# EAGLE design LED PCB (EAGLE 9.6.1)
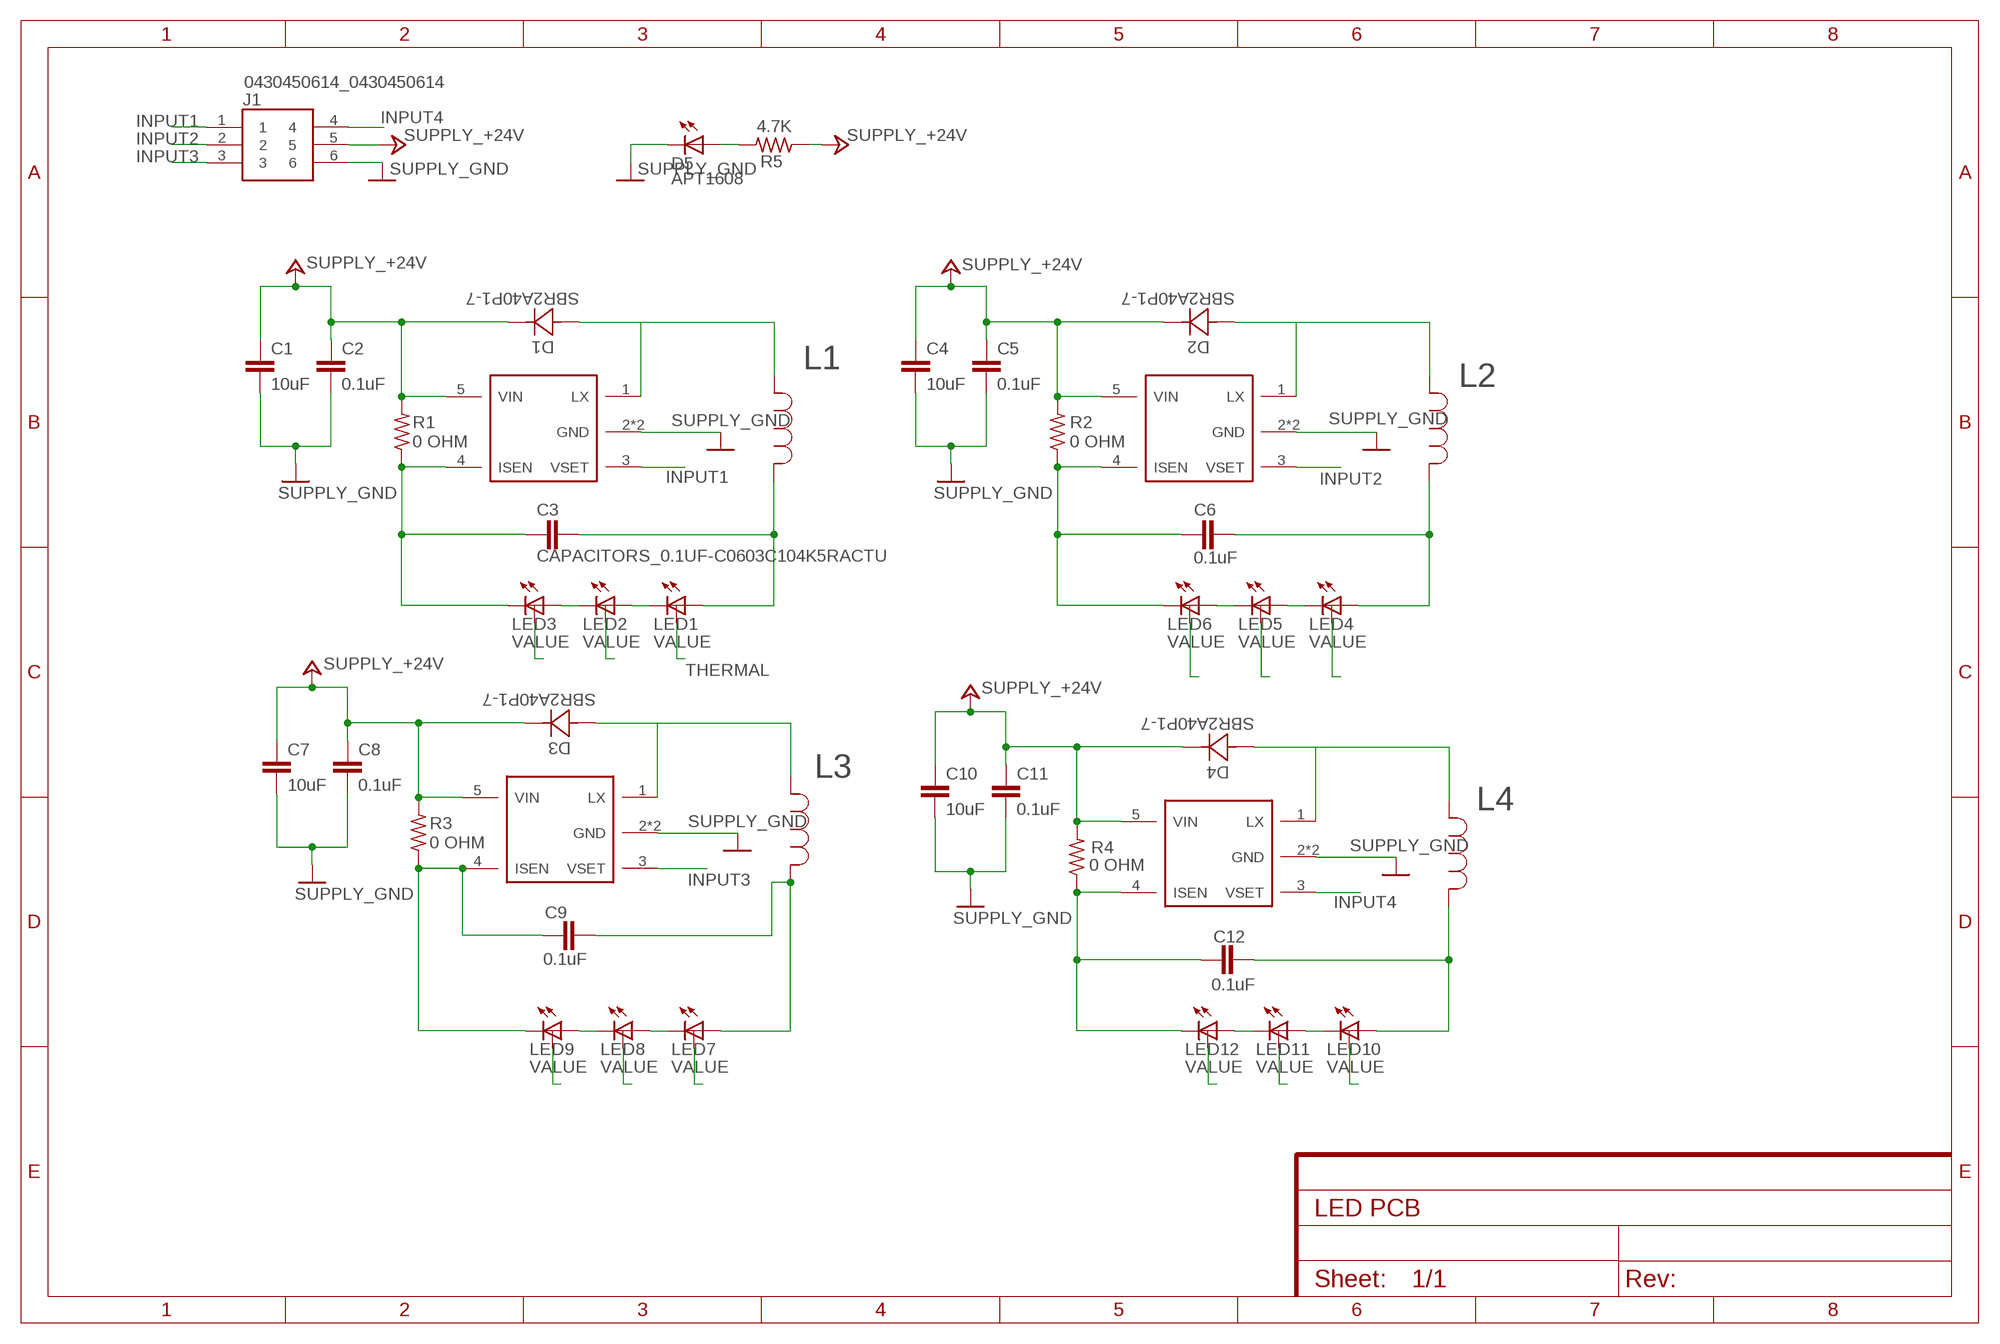
[diagram p0: schematic, sheet 1]

## Parts
C1  10uF  CAPACITORS_10UF-GMK212BBJ106KG-T  [CAPACITORS_C0805]
C2  0.1uF  CAPACITORS_0.1UF-C0603C104K5RACTU  [CAPACITORS_C0603]
C3  CAPACITORS_0.1UF-C0603C104K5RACTU  [CAPACITORS_C0603]
C4  10uF  CAPACITORS_10UF-GMK212BBJ106KG-T  [CAPACITORS_C0805]
C5  0.1uF  CAPACITORS_0.1UF-C0603C104K5RACTU  [CAPACITORS_C0603]
C6  0.1uF  CAPACITORS_0.1UF-C0603C104K5RACTU  [CAPACITORS_C0603]
C7  10uF  CAPACITORS_10UF-GMK212BBJ106KG-T  [CAPACITORS_C0805]
C8  0.1uF  CAPACITORS_0.1UF-C0603C104K5RACTU  [CAPACITORS_C0603]
C9  0.1uF  CAPACITORS_0.1UF-C0603C104K5RACTU  [CAPACITORS_C0603]
C10  10uF  CAPACITORS_10UF-GMK212BBJ106KG-T  [CAPACITORS_C0805]
C11  0.1uF  CAPACITORS_0.1UF-C0603C104K5RACTU  [CAPACITORS_C0603]
C12  0.1uF  CAPACITORS_0.1UF-C0603C104K5RACTU  [CAPACITORS_C0603]
D1  SBR2A40P1-7  DIODES_SBR2A40P1-7  [DIODES_POWERDI123]
D2  SBR2A40P1-7  DIODES_SBR2A40P1-7  [DIODES_POWERDI123]
D3  SBR2A40P1-7  DIODES_SBR2A40P1-7  [DIODES_POWERDI123]
D4  SBR2A40P1-7  DIODES_SBR2A40P1-7  [DIODES_POWERDI123]
D5  APT1608  DIODES_APT1608CGCK  [DIODES_CHIPLED_0603]
J1  0430450614_0430450614  [0430450614_MOLEX_0430450614]
L1  INDUCTORS_100UH_BOURNES  [INDUCTORS_IND_BOURNS_SDR1307]
L2  INDUCTORS_100UH_BOURNES  [INDUCTORS_IND_BOURNS_SDR1307]
L3  INDUCTORS_100UH_BOURNES  [INDUCTORS_IND_BOURNS_SDR1307]
L4  INDUCTORS_100UH_BOURNES  [INDUCTORS_IND_BOURNS_SDR1307]
LED1  PFCEDU_V4_TOMASZEWSKI_LED_W/THERM-CREE_XP-E2  [TOMASZEWSKI_CREE-XLAMP@1]
LED2  TOMASZEWSKI_LED_W/THERM-CREE_XP-E2  PFCEDU_V4_TOMASZEWSKI_LED_W/THERM-CREE_XP-E2  [TOMASZEWSKI_CREE-XLAMP@1]
LED3  PFCEDU_V4_TOMASZEWSKI_LED_W/THERM-CREE_XP-E2  [TOMASZEWSKI_CREE-XLAMP@1]
LED4  PFCEDU_V4_TOMASZEWSKI_LED_W/THERM-CREE_XP-E2  [TOMASZEWSKI_CREE-XLAMP@1]
LED5  PFCEDU_V4_TOMASZEWSKI_LED_W/THERM-CREE_XP-E2  [TOMASZEWSKI_CREE-XLAMP@1]
LED6  PFCEDU_V4_TOMASZEWSKI_LED_W/THERM-CREE_XP-E2  [TOMASZEWSKI_CREE-XLAMP@1]
LED7  PFCEDU_V4_TOMASZEWSKI_LED_W/THERM-CREE_XP-E2  [TOMASZEWSKI_CREE-XLAMP@1]
LED8  PFCEDU_V4_TOMASZEWSKI_LED_W/THERM-CREE_XP-E2  [TOMASZEWSKI_CREE-XLAMP@1]
LED9  PFCEDU_V4_TOMASZEWSKI_LED_W/THERM-CREE_XP-E2  [TOMASZEWSKI_CREE-XLAMP@1]
LED10  PFCEDU_V4_TOMASZEWSKI_LED_W/THERM-CREE_XP-E2  [TOMASZEWSKI_CREE-XLAMP@1]
LED11  PFCEDU_V4_TOMASZEWSKI_LED_W/THERM-CREE_XP-E2  [TOMASZEWSKI_CREE-XLAMP@1]
LED12  PFCEDU_V4_TOMASZEWSKI_LED_W/THERM-CREE_XP-E2  [TOMASZEWSKI_CREE-XLAMP@1]
R1  0 OHM  RESISTORS_0OHM-RC0603JR-070RL  [RESISTORS_RC0603N]
R2  0 OHM  RESISTORS_0OHM-RC0603JR-070RL  [RESISTORS_RC0603N]
R3  0 OHM  RESISTORS_0OHM-RC0603JR-070RL  [RESISTORS_RC0603N]
R4  0 OHM  RESISTORS_0OHM-RC0603JR-070RL  [RESISTORS_RC0603N]
R5  4.7K  RESISTORS_4.7K-RC1206JR-074K7L  [RESISTORS_R1206]
U$1  DRIVER-IC_AL8861  [DRIVER-IC_AL8861]
U$3  DRIVER-IC_AL8861  [DRIVER-IC_AL8861]
U$5  DRIVER-IC_AL8861  [DRIVER-IC_AL8861]
U$7  DRIVER-IC_AL8861  [DRIVER-IC_AL8861]

## Nets
+24V: C1.1 C2.1 C4.1 C5.1 C7.1 C8.1 C10.1 C11.1 D1.- D2.- D3.- D4.- J1.5 R1.2 R2.2 R3.2 R4.2 R5.1 U$1.5(VIN) U$3.5(VIN) U$5.5(VIN) U$7.5(VIN) ; supply symbol labelled SUPPLY_+24V
GND: C1.2 C2.2 C4.2 C5.2 C7.2 C8.2 C10.2 C11.2 D5.C J1.6 U$1.2(GND) U$1.44(GND) U$3.2(GND) U$3.44(GND) U$5.2(GND) U$5.44(GND) U$7.2(GND) U$7.44(GND) ; supply symbol labelled SUPPLY_GND
INPUT1: J1.1 U$1.3(VSET)
INPUT2: J1.2 U$3.3(VSET)
INPUT3: J1.3 U$5.3(VSET)
INPUT4: J1.4 U$7.3(VSET)
N$1: C3.1 LED3.C LED3.C@1(C) R1.1 U$1.4(ISEN)
N$2: D1.+ L1.2 U$1.1(LX)
N$3: C9.2 L3.1 LED7.A LED7.A@1(A)
N$4: C3.2 L1.1 LED1.A LED1.A@1(A)
N$5: LED2.C LED2.C@1(C) LED3.A LED3.A@1(A)
N$6: LED1.C LED1.C@1(C) LED2.A LED2.A@1(A)
N$7: D3.+ L3.2 U$5.1(LX)
N$8: LED5.C LED5.C@1(C) LED6.A LED6.A@1(A)
N$9: LED4.C LED4.C@1(C) LED5.A LED5.A@1(A)
N$10: C12.1 LED12.C LED12.C@1(C) R4.1 U$7.4(ISEN)
N$11: D4.+ L4.2 U$7.1(LX)
N$12: LED8.C LED8.C@1(C) LED9.A LED9.A@1(A)
N$13: LED7.C LED7.C@1(C) LED8.A LED8.A@1(A)
N$14: LED6.THERM
N$15: LED5.THERM
N$16: LED11.C LED11.C@1(C) LED12.A LED12.A@1(A)
N$17: LED10.C LED10.C@1(C) LED11.A LED11.A@1(A)
N$18: C6.1 LED6.C LED6.C@1(C) R2.1 U$3.4(ISEN)
N$19: D2.+ L2.2 U$3.1(LX)
N$20: C6.2 L2.1 LED4.A LED4.A@1(A)
N$21: C12.2 L4.1 LED10.A LED10.A@1(A)
N$22: C9.1 LED9.C LED9.C@1(C) R3.1 U$5.4(ISEN)
N$23: D5.A R5.2
N$24: LED4.THERM
N$25: LED9.THERM
N$26: LED8.THERM
N$27: LED7.THERM
N$28: LED12.THERM
N$29: LED11.THERM
N$30: LED10.THERM
N$32: LED3.THERM
N$44: LED2.THERM
THERMAL: LED1.THERM

## Library data of the parts
C1 C4 C7 C10 = LED:CAPACITORS_10UF-GMK212BBJ106KG-T: CAP CER 10UF 35V X5R 0805 Description: 10µF ±10% 35V Ceramic Capacitor X5R 0805 (2012 Metric) Technical Specifications: Capacitance: 10µF Tolerance: ±10% Rated Voltage: 35V Temperature Coefficient: X5R Operating Temperature: -55°C ~ 85°C Package / Case: 0805 (2012 Metric) Datasheet(s): GMK212BBJ106KG-T Spec <http://ds.yuden.co.jp/TYCOMPAS/ut/detail.do?productNo=GMK212BBJ106KG-T&fileName=GMK212BBJ106KG-T_SS&mode=specSheetDownload> Vendor(s): Digikey: 587-4893-1-ND <https://www.digikey.com/product-detail/en/taiyo-yuden/GMK212BBJ106KG-T/587-4893-1-ND/6563736>; MANUFACTURER: Taiyo Yuden; MPN: GMK212BBJ106KG-T; VENDOR: Digikey; VLINK: https://www.digikey.com/product-detail/en/taiyo-yuden/GMK212BBJ106KG-T/587-4893-1-ND/6563736; VPN: 587-4893-1-ND
C2 C5 C6 C8 C9 C11 C12 = LED:CAPACITORS_0.1UF-C0603C104K5RACTU: CAP CER 0.1UF 50V X7R 0603 Description: 0.1µF ±10% 50V Ceramic Capacitor X7R 0603 (1608 Metric) Technical Specifications: Capacitance: 0.1µF Tolerance: ±10% Rated Voltage: 50V Temperature Coefficient: X7R Operating Temperature: -55°C ~ 125°C Package / Case: 0603 (1608 Metric) Datasheet(s): X7R Dielectric, 6.3-250 VDC <https://search.kemet.com/component-edge/download/datasheet/C0603C104K5RACTU.pdf> Vendor(s): Digikey: 399-5089-1-ND <https://www.digikey.com/product-detail/en/kemet/C0603C104K5RACTU/399-5089-1-ND/1465623>; MANUFACTURER: Kemet; MPN: C0603C104K5RACTU; VENDOR: Digikey; VLINK: https://www.digikey.com/product-detail/en/kemet/C0603C104K5RACTU/399-5089-1-ND/1465623; VPN: 399-5089-1-ND
C3 = LED:CAPACITORS_0.1UF-C0603C104K5RACTU: CAP CER 0.1UF 50V X7R 0603 Description: 0.1µF ±10% 50V Ceramic Capacitor X7R 0603 (1608 Metric) Technical Specifications: Capacitance: 0.1µF Tolerance: ±10% Rated Voltage: 50V Temperature Coefficient: X7R Operating Temperature: -55°C ~ 125°C Package / Case: 0603 (1608 Metric) Datasheet(s): X7R Dielectric, 6.3-250 VDC <https://search.kemet.com/component-edge/download/datasheet/C0603C104K5RACTU.pdf> Vendor(s): Digikey: 399-5089-1-ND <https://www.digikey.com/product-detail/en/kemet/C0603C104K5RACTU/399-5089-1-ND/1465623>; MANUFACTURER: Kemet; MPN: C0603C104K5RACTU; VALUE: 0.1uF; VENDOR: Digikey; VLINK: https://www.digikey.com/product-detail/en/kemet/C0603C104K5RACTU/399-5089-1-ND/1465623; VPN: 399-5089-1-ND
D1-D4 = LED:DIODES_SBR2A40P1-7: DIODE SBR 40V 2A POWERDI123 Description: Diode Super Barrier 40V 2A Surface Mount PowerDI™ 123 Technical Specifications: Diode Type: Super Barrier Voltage - DC Reverse (Vr) (Max): 40V Current - Average Rectified (Io): 2A Voltage - Forward (Vf) (Max) @ If: 500mV @ 2A Speed: Standard Recovery >500ns, > 200mA (Io) Current - Reverse Leakage @ Vr: 100µA @ 40V Mounting Type: Surface Mount Package / Case: POWERDI®123 Supplier Device Package: PowerDI™ 123 Operating Temperature - Junction: -65°C ~ 150°C Base Part Number: SBR2A40 Datasheet(s): SBR2A40P1 <https://www.diodes.com/assets/Datasheets/SBR2A40P1.pdf> Vendor(s): Digikey: SBR2A40P1DITR-ND <https://www.digikey.com/product-detail/en/diodes-incorporated/SBR2A40P1-7/SBR2A40P1DITR-ND/1681825>; MANUFACTURER: Diodes Incorporated; MPN: SBR2A40P1-7; VENDOR: Digikey; VLINK: https://www.digikey.com/product-detail/en/diodes-incorporated/SBR2A40P1-7/SBR2A40P1DITR-ND/1681825; VPN: SBR2A40P1DITR-ND
D5 = LED:DIODES_APT1608CGCK: LED GREEN CLEAR 0603 SMD Description: Green 570nm LED Indication - Discrete 2.1V 0603 (1608 Metric) Technical Specifications: Color: Green Lens Color: Colorless Lens Transparency: Clear Millicandela Rating: 50mcd Lens Style/Size: Rectangle with Flat Top, 1.20mm x 0.80mm Voltage - Forward (Vf) (Typ): 2.1V Current - Test: 20mA Viewing Angle: 120° Mounting Type: Surface Mount Wavelength - Dominant: 570nm Wavelength - Peak: 574nm Package / Case: 0603 (1608 Metric) Supplier Device Package: Chip LED Size / Dimension: 1.60mm L x 0.80mm W Height (Max): 0.75mm Datasheet(s): APT1608CGCK <http://www.kingbrightusa.com/images/catalog/SPEC/APT1608CGCK.pdf> Vendor(s): Digikey: 754-1116-1-ND <https://www.digikey.com/product-detail/en/kingbright/APT1608CGCK/754-1116-1-ND/1747833#>; MANUFACTURER: Kingbright; MPN: APT1608CGCK; VENDOR: Digikey; VLINK: https://www.digikey.com/product-detail/en/kingbright/APT1608CGCK/754-1116-1-ND/1747833#; VPN: 754-1116-1-ND
J1 = LED:0430450614_0430450614: Conn Power HDR 6 POS 3mm Solder ST Thru-Hole 6 Terminal 1 Port Micro-Fit 3.0Ã¢â¢ Tray; AVAILABILITY: Unavailable; DESCRIPTION: Connector Header Through Hole 6 position 0.118 _3.00mm_; MF: Molex; MP: 0430450614; PACKAGE: None; PRICE: None
L1-L4 = LED:INDUCTORS_100UH_BOURNES: Bourne - FIXED IND 100UH 1.9A 180 MOHM Technical Specifications: Inductance: 100uH Rated Current: 1.9A Saturation Current: 3.0A DC Resistance: 180mΩ Operating Temperature: -40° C to 125°C Datasheet(s): 100uH Bourne <http://www.bourns.com/docs/Product-Datasheets/SDR1307.pdf> Vendors: Digikey: SDR1307-101KLCT-ND <https://www.digikey.com/product-detail/en/bourns-inc/SDR1307-101KL/SDR1307-101KLCT-ND/3437739>
LED1 LED3-LED12 = LED:PFCEDU_V4_TOMASZEWSKI_LED_W/THERM
LED2 = LED:PFCEDU_V4_TOMASZEWSKI_LED_W/THERM; SPICEPREFIX: J
R1-R4 = LED:RESISTORS_0OHM-RC0603JR-070RL: RES SMD 0 OHM JUMPER 1/10W 0603 Description: 0 Ohms Jumper 0.1W, 1/10W Chip Resistor 0603 (1608 Metric) Moisture Resistant Thick Film Technical Specifications: Resistance: 0 Ohms Power: 0.1W, 1/10W Operating Temperature: -55°C ~ 155°C Package / Case: 0603 (1608 Metric) Datasheet(s): RC Series, L Datasheet <http://www.yageo.com/documents/recent/PYu-RC_Group_51_RoHS_L_8.pdf> Vendor(s): Digikey: 311-0.0GRCT-ND <https://www.digikey.com/product-detail/en/yageo/RC0603JR-070RL/311-0.0GRCT-ND/729622>; MANUFACTURER: Yageo; MPN: RC0603JR-070RL; VENDOR: Digikey; VLINK: https://www.digikey.com/product-detail/en/yageo/RC0603JR-070RL/311-0.0GRCT-ND/729622; VPN: 311-0.0GRCT-ND
R5 = LED:RESISTORS_4.7K-RC1206JR-074K7L: RES SMD 4.7K OHM 5% 1/4W 1206 Description: 4.7 kOhms ±5% 0.25W, 1/4W Chip Resistor 1206 (3216 Metric) Moisture Resistant Thick Film Technical Specifications: Resistance: 4.7 kOhms Tolerance: ±5% Power (Watts): 0.25W, 1/4W Composition: Thick Film Features: Moisture Resistant Temperature Coefficient: ±100ppm/°C Operating Temperature: -55°C ~ 155°C Package / Case: 1206 (3216 Metric) Supplier Device Package: 1206 Size / Dimension: 0.122" L x 0.063" W (3.10mm x 1.60mm) Height - Seated (Max): 0.026" (0.65mm) Number of Terminations: 2 Datasheet(s): Thick Film Chip Resistor Intro <http://www.yageo.com.tw/exep/pages/download/literatures/PYu-R_INT-thick_7.pdf> Chip Resistor Marking <http://www.yageo.com/exep/pages/download/literatures/PYu-R_Marking_2.pdf> RC Series, L Datasheet <http://www.yageo.com/documents/recent/PYu-RC_Group_51_RoHS_L_8.pdf> Vendor(s): Digikey: 311-4.7KERCT-ND <https://www.digikey.com/product-detail/en/yageo/RC1206JR-074K7L/311-4.7KERCT-ND/732242>; MANUFACTURER: Yageo; MPN: RC1206JR-074K7L; VENDOR: Digikey; VLINK: https://www.digikey.com/product-detail/en/yageo/RC1206JR-074K7L/311-4.7KERCT-ND/732242; VPN: 311-4.7KERCT-ND
U$1 U$3 U$5 U$7 = LED:DRIVER-IC_AL8861: AL8861 LED Driver IC Description: IC LED DRVR REG PWM 1.5A SOT89-5 Technical Specifications: Type: IC Voltage In: 4.5V - 40V Current Out: Up to 1.5A Frequency: 1Mhz Dimming: PWM or Analog Package SOT-89-5 Operating Temperature: -40°C ~ 85°C (TA) Datasheet(s): Diodes AL8861 <https://www.mouser.com/ds/2/115/AL8861-1094677.pdf> Vendor(s): Digikey: Diodes AL8861 <https://www.digikey.com/product-detail/en/diodes-incorporated/AL8861Y-13/AL8861Y-13DICT-ND/6702378>

## Board
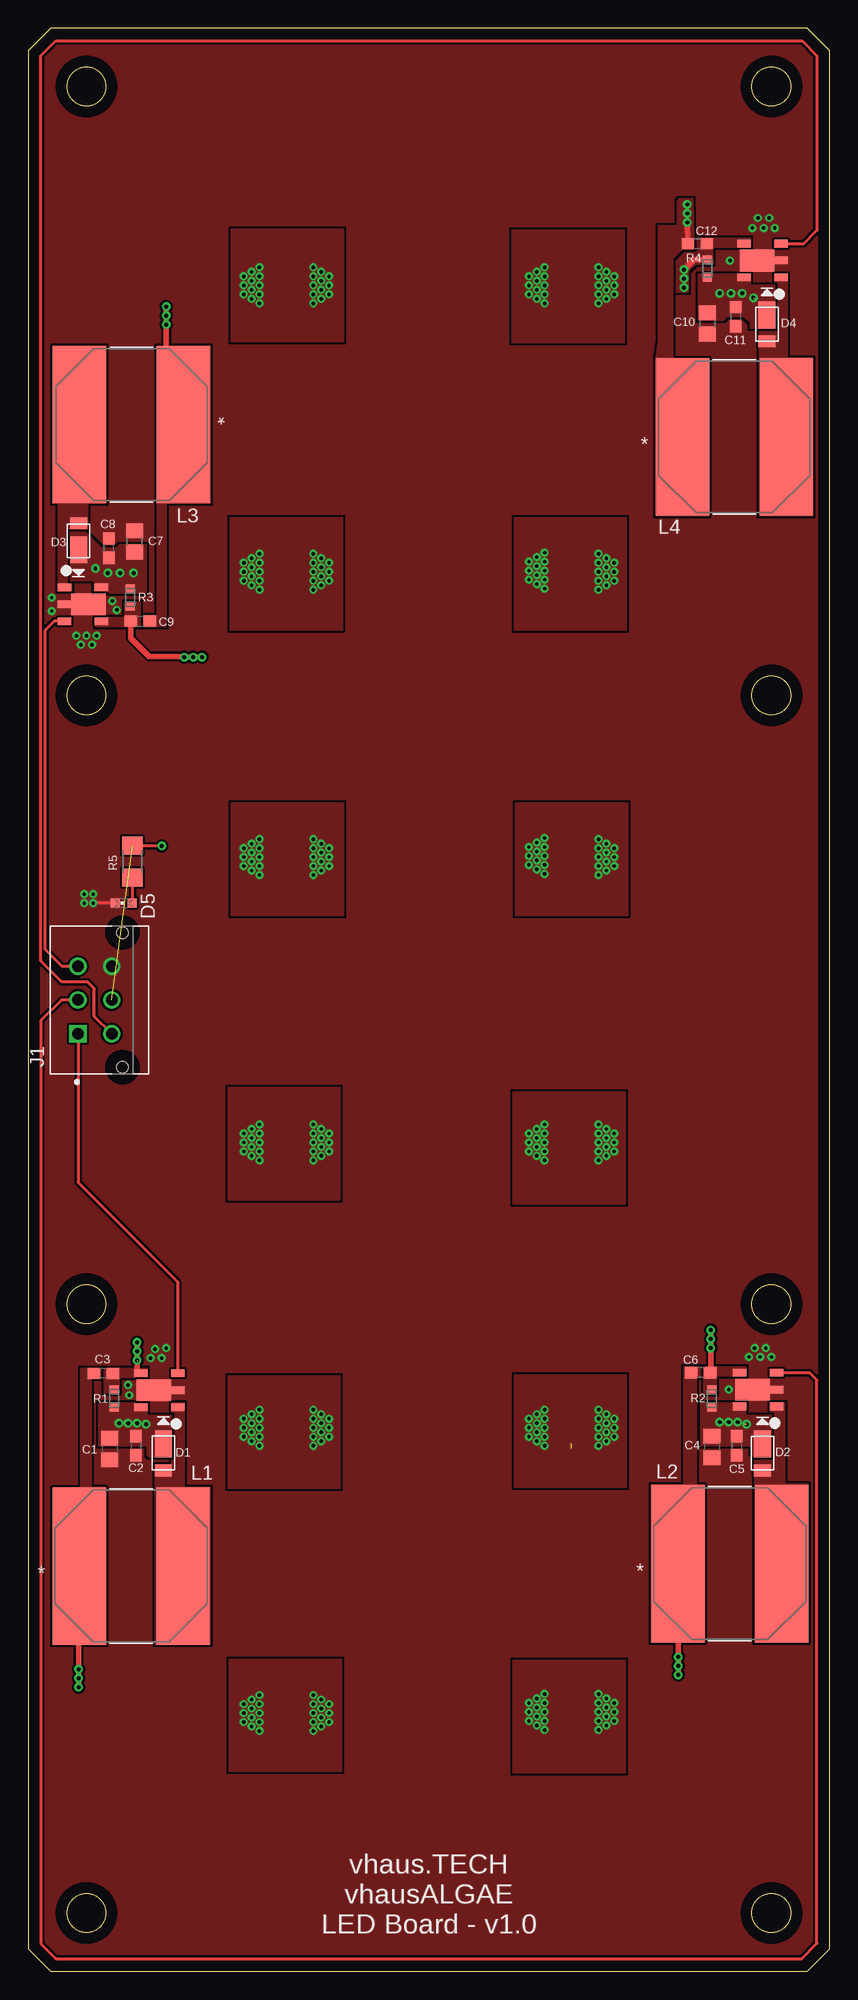
[diagram p1: board, top side]
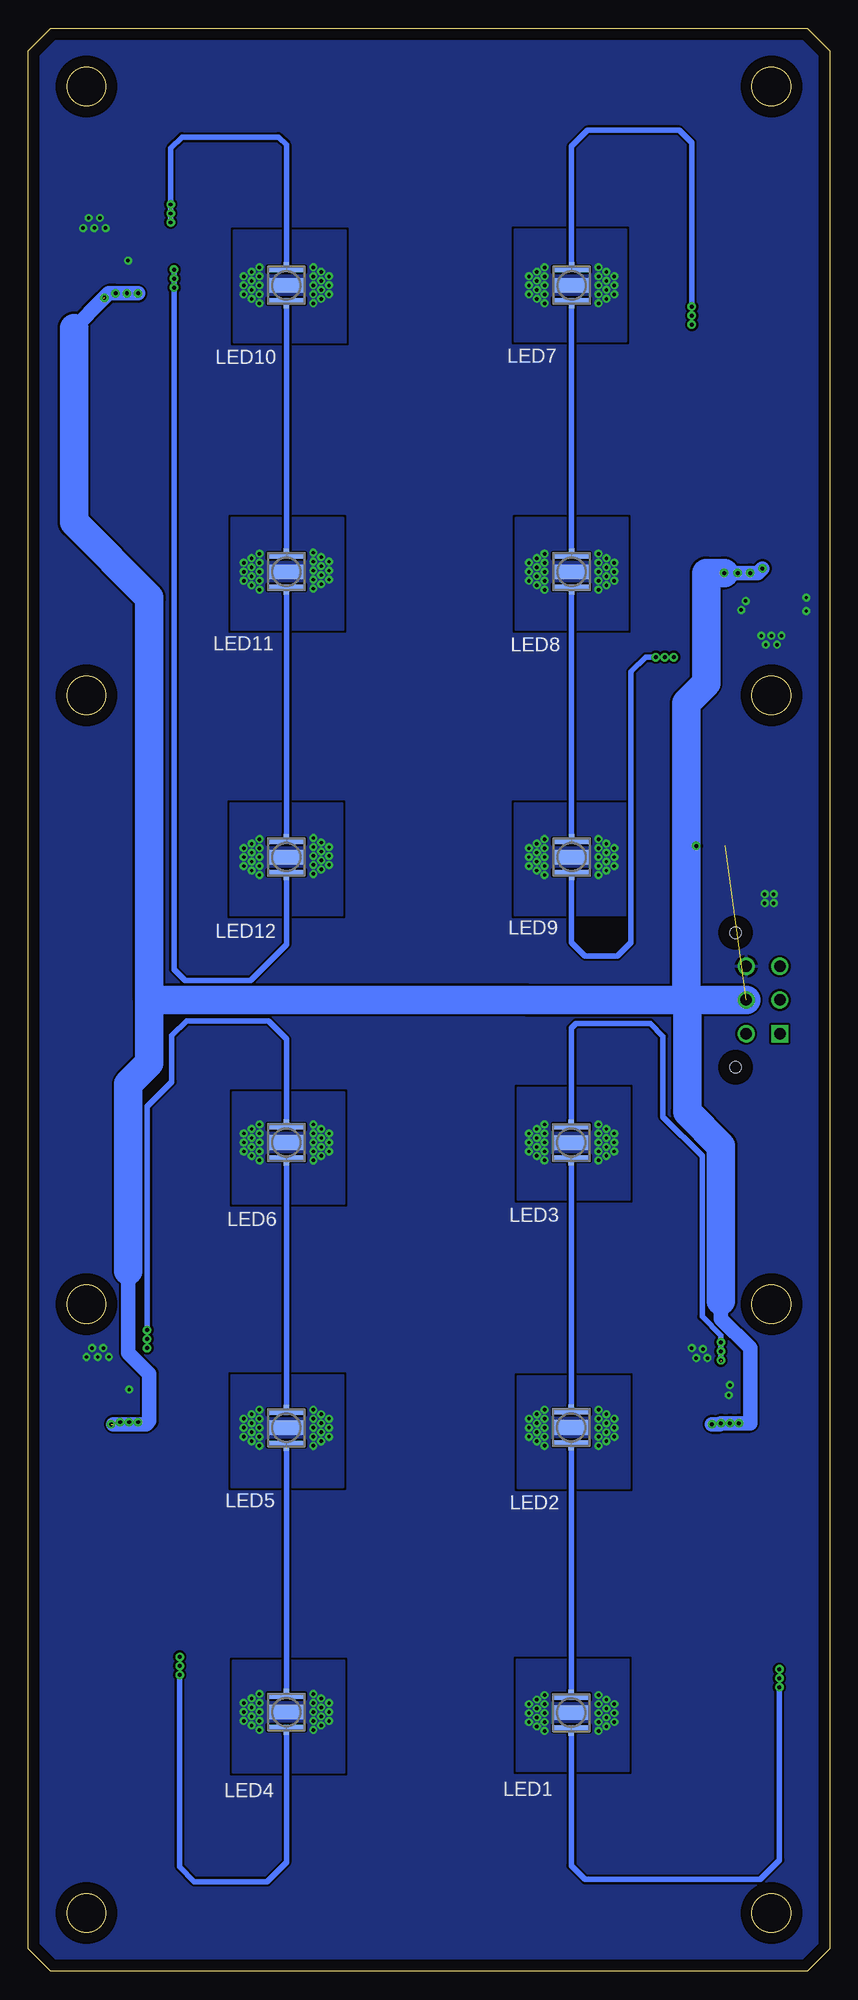
[diagram p2: board, bottom side, seen from below]

Size 71.4 x 173 mm. Coordinates in mm from the lower left corner, seen from the top.
Outline: 71.4,171 69.4,173 2,173 0,171 0,2 2,0 69.4,0 71.4,2 71.4,171
Outline: circle at 5.2,167.8 radius 1.73
Outline: circle at 5.2,5.2 radius 1.73
Outline: circle at 66.2,5.2 radius 1.73
Outline: circle at 66.2,113.6 radius 1.73
Outline: circle at 66.2,59.4 radius 1.73
Outline: circle at 5.2,59.4 radius 1.73
Outline: circle at 5.2,113.6 radius 1.73
Outline: circle at 66.2,167.8 radius 1.73
Copper layers (1*16): Top 0.035mm / dielectric 1.5mm / Bottom 0.035mm
Design rules "default *": minimum track width 6mil, minimum drill 0.35mm, track to track 6mil, track to pad 6mil, pad to pad 6mil, via to via 6mil, smd to smd 6mil, copper to edge 40mil, drill to drill 6mil, minimum pad ring 10mil, minimum via ring 8mil, stop-mask expansion 4mil, vias tented up to drill 0.35mm, thermal gap 10mil

### Footprints (pad centres in the part's own frame; a part is rotated, then mirrored left to right if it is on the bottom)
CAPACITORS_C0805 = smd 1.3 x 1.5: 1 -0.95,0; 2 0.95,0
CAPACITORS_C0603 = smd 1.1 x 1: 1 -0.85,0; 2 0.85,0
DIODES_POWERDI123 = smd 1.05 x 1.5: + -1.3,0 | smd 2.4 x 1.5: - 1.05,0
DIODES_CHIPLED_0603 = smd 0.8 x 0.8: A 0,-0.75; C 0,0.75
0430450614_MOLEX_0430450614 = drill 1.02 square: 1 -3,1.5 | drill 1.02: 2 0,1.5; 3 3,1.5; 4 -3,-1.5; 5 0,-1.5; 6 3,-1.5 | hole 1.02: 6,-2.44; -6,-2.44
INDUCTORS_IND_BOURNS_SDR1307 = smd 4.75 x 13.995: 1 -4.623,0; 2 4.623,0
TOMASZEWSKI_CREE-XLAMP@1 = smd 0.5 x 3.3: A 1.4,0; C -1.4,0 | smd 0.45 x 0.5: A@1 1.825,0; C@1 -1.825,0 | smd 1.3 x 3.3: THERM 0,0
RESISTORS_RC0603N = smd 0.756 x 0.8: 1 -0.778,0; 2 0.778,0
RESISTORS_R1206 = smd 1.6 x 1.803: 1 -1.422,0; 2 1.422,0
DRIVER-IC_AL8861 = smd 0.68 x 1.2: 1 -1.5,-1.65; 2 0,-1.65; 3 1.5,-1.65; 4 1.5,1.65; 5 -1.5,1.65 | smd 1.93 x 3.05: 44 0,0.475

### Placement (x,y rotation side)
C1  7.27,46.52 270 top
C2  9.6,46.8 270 top
C3  6.7,53.25 180 top
C4  60.9,46.7 270 top
C5  63.1,46.8 270 top
C6  59.9,53.3 180 top
C7  9.5,127.3 90 top
C8  7.2,126.7 90 top
C9  10,120.2 0 top
C10  60.5,146.7 270 top
C11  63,147.3 270 top
C12  59.6,153.8 180 top
D1  12.06,45.92 90 top
D2  65.4,45.9 90 top
D3  4.5,127.6 270 top
D4  65.8,146.4 90 top
D5  8.5,95.1 90 top
J1  5.95,86.48 90 top
L1  9.19,36.09 0 top
L2  62.5,36.3 0 top
L3  9.2,137.7 180 top
L4  62.9,136.6 0 top
LED1  23.02,23.04 270 bottom
LED2  23.02,48.43 270 bottom
LED3  23.02,73.79 270 bottom
LED4  48.4,23.1 270 bottom
LED5  48.4,48.4 270 bottom
LED6  48.4,73.8 270 bottom
LED7  23,150.1 90 bottom
LED8  23,124.6 90 bottom
LED9  23,99.2 90 bottom
LED10  48.4,150.1 90 bottom
LED11  48.4,124.6 90 bottom
LED12  48.4,99.2 90 bottom
R1  7.66,51 270 top
R2  60.9,51 270 top
R3  9.1,122.3 90 top
R4  60.5,151.6 270 top
R5  9.3,98.8 270 top
U$1  11.68,51.75 90 top
U$3  65,51.8 90 top
U$5  4.9,121.7 270 top
U$7  65.4,152.3 90 top

### Tracks (layer width: path | path; a pad name or v marks a point on that pad's centre or on a via)
+24V  (via drill 0.35)  (3 unrouted)
  Top 0.254: v11.9,100.2 9.32,100.2 R5.1
  Bottom 1.27: 67.3,146.3 64.7,148.9 | 62.48,62.36 62.48,55.08 60.6,53.2 60.6,49 60.9,48.7 63.8,48.7 | 9.7,59.7 9.7,58.1 7.1,55.5 7.1,48.8 v8.1,48.8 v8.9,48.8 v9.7,48.8 9.8,48.7 v10.5,48.7 | v6,124.9 6.4,124.5 v7.1,124.5 v8.2,124.5 v9.4,124.5 | v61.6,149.4 v62.6,149.4 v63.6,149.4 64.2,149.4 v64.6,149
  Bottom 2.54: J1.5 12.8,86.48 | 12.8,86.48 27.1,86.48 27.12,86.5 60.6,86.5 | 12.8,86.48 12.8,112.9 11,114.7 11,124.5 v9.4,124.5 | 67.3,146.3 67.3,129 60.6,122.3 60.6,86.5 | 12.8,86.48 12.7,86.38 12.7,76.5 9.7,73.5 9.7,59.7 | 60.6,86.5 60.6,80.87 62.48,78.99 62.48,62.36
  other vias: 61.6,48.9 62.4,48.9 63.2,48.9 64,48.7
  pour Top (isolate 0.2, no thermals): 64.3,151.1 59.7,151.1 59.7,147 61.9,147 62.2,147.3 63.8,147.3 64.3,146.8 64.3,146.3 66.5,146.3 66.5,150 66.4,150.1 64.3,150.1 64.3,150.6
  pour Top (isolate 0.2, no thermals): 3.8,128.2 3.8,123.8 5.9,123.8 5.9,122.9 7.1,122.9 7.3,122.7 10.5,122.7 10.5,127 8.2,127 7.9,126.7 6.5,126.7 5,128.2
  pour Top (isolate 0.2, no thermals): 12.8,45.8 10.8,45.8 10.6,46 10.6,46.8 6.3,46.8 6.3,50.5 6.4,50.6 10.6,50.6 10.6,49.5 12.8,49.5
  pour Top (isolate 0.2, no thermals): 66.2,45.8 64.7,45.8 64.4,46.1 64.4,46.7 64.3,46.8 59.9,46.8 59.9,50.6 63.9,50.6 63.9,49.5 66.2,49.5
GND  (via drill 0.3)
  Top 0.254: D5.C v5.8,95.1
  other vias: 7.5,122 7.9,121.2 2.1,122.3 2.1,121.1 4.3,118.9 5.2,118.9 6.1,118.9 5.7,118.1 4.7,118.1 62.5,152.3 64.5,155.2 65.5,155.2 66.5,155.2 66,156.1 65,156.1 62.4,51.8 64.2,54.7 65.2,54.7 66.2,54.7 65.7,55.5 64.7,55.5 10.9,54.6 11.9,54.6 11.3,55.4 12.3,55.5 8.9,52.2 9,51.3 5,95.1 5.8,95.9 5,95.9
  pour Top (isolate 0.2, rank 6, no thermals): 69.4,173 1.9,173 -0.1,171 -0.1,2 1.9,0 69.4,0 71.4,2 71.4,171
  pour Bottom (isolate 0.2, rank 3): 70,173.8 2.1,173.8 -0.4,171.3 -0.4,1.9 2.5,-1 69.2,-1 72.4,2.2 72.4,171.5 72,171.9
INPUT1
  Top 0.254: J1.1 4.45,70.25 13.33,61.37 U$1.3
INPUT2
  Top 0.254: J1.2 2.98,86.48 1.14,84.64 1.14,2.47 2.47,1.14 68.9,1.14 70.26,2.5 70.26,52.64 69.6,53.3 U$3.3
INPUT3
  Top 0.254: J1.3 3.02,89.48 1.55,90.95 1.55,119.4 2.35,120.2 U$5.3
INPUT4
  Top 0.254: J1.4 5.9,85.03 5.9,87.5 5.3,88.1 3,88.1 1.14,89.96 1.14,170.53 2.47,171.86 68.93,171.86 70.26,170.53 70.26,155 69.06,153.8 U$7.3
N$1  (via drill 0.35)  (1 unrouted)
  Top 0.508: U$1.4 9.7,53.58 v9.7,54.4 v9.7,55.2 v9.7,56
  Bottom 0.508: LED3.C LED3.C@1 23.02,83.98 22.6,84.4 16,84.4 14.85,83.25 14.85,76.05 11.38,72.58 11.38,58.3 9.7,56.63 9.7,54.3
  pour Top (isolate 0.2, no thermals): 10.6,53.7 6.8,53.7 6.8,51.5 8.1,51.5 8.1,52.9 10.6,52.9
N$2
  pour Top (isolate 0.2, rank 2, no thermals): 11.3,45.1 11.3,29.1 16.2,29.1 16.2,43.1 13.9,43.1 13.9,50.6 12.8,50.6 12.8,45.1
N$3  (via drill 0.35)
  Top 0.508: v12.3,148.2 v12.3,147.4 v12.3,146.6 12.3,143.8
  Bottom 0.508: LED7.A LED7.A@1 23,162.5 21.6,163.9 13.4,163.9 12.3,162.8 v12.3,148.2
  pour Top (isolate 0.2, rank 2, no thermals): 11.5,120.7 10.1,120.7 10.1,119.7 12.3,119.7 12.3,130.7 16.2,130.7 16.2,144.7 11.5,144.7
N$4  (via drill 0.35)
  Top 0.508: v4.5,25.3 v4.5,26.1 v4.5,26.9 4.5,36.02 L1.1
  Bottom 0.508: LED1.A LED1.A@1 23.02,9.42 21.8,8.2 6.2,8.2 4.5,9.9 v4.5,25.3
  pour Top (isolate 0.2, rank 2, no thermals): 6.6,53.7 4.7,53.7 4.7,43 2.2,43 2.2,29.1 6.9,29.1 6.9,43 6.8,43.1 5.6,43.1 5.6,52.8 6.6,52.8
N$5
  Bottom 0.508: LED3.A LED3.A@1 LED2.C@1 LED2.C
N$6
  Bottom 0.508: LED2.A LED2.A@1 LED1.C@1 LED1.C
N$7
  pour Top (isolate 0.2, rank 2, no thermals): 3.9,122.9 2.7,122.9 2.7,130.7 2.2,130.7 2.2,144.7 6.9,144.7 6.9,130.7 5.3,130.7 5.3,128 3.7,128 3.7,123.5 3.9,123.5
N$8
  Bottom 0.508: LED5.C LED5.C@1 LED6.A@1 LED6.A
N$9  (1 unrouted)
  Bottom 0.508: LED4.C LED4.C@1 LED5.A@1
N$10  (via drill 0.35)
  Top 0.508: R4.1 59.28,152.38 v58.4,151.5
  Bottom 0.508: LED12.C LED12.C@1 48.4,91.4 51.6,88.2 57.4,88.2 58.4,89.2 v58.4,149.9 v58.4,150.7 v58.4,151.5
  pour Top (isolate 0.2, rank 3, no thermals): 59.4,154.3 64.3,154.3 64.3,153.5 61,153.5 61,152 59.4,152 58.8,151.4 58.8,149.5 57.6,149.5 57.6,152.4 58.3,153.1 59.4,153.1
N$11
  pour Top (isolate 0.2, rank 2, no thermals): 66.5,151.1 66.5,146.1 65.1,146.1 65.1,129.6 69.9,129.6 69.9,143.6 67.6,143.6 67.6,151.1
N$12
  Bottom 0.508: LED8.C LED8.C@1 LED9.A@1 LED9.A
N$13
  Bottom 0.508: LED7.C LED7.C@1 LED8.A@1 LED8.A
N$14  (via drill 0.3)
  other vias: 50.8,73.8 50.8,74.6 50.8,75.4 50.8,73 50.8,72.2 51.5,72.6 51.5,73.4 51.5,74.2 51.5,75 52.2,74.6 52.2,73.8 52.2,73 46,73.8 46,74.6 46,75.4 46,73 46,72.2 45.3,72.6 45.3,73.4 45.3,74.2 45.3,75 44.6,74.6 44.6,73.8 44.6,73
  pour Top (isolate 0.2, no thermals): 43.2,78.3 43.2,68.3 53.2,68.3 53.2,78.3
  pour Bottom (isolate 0.2, no thermals): 43.2,78.3 43.2,68.3 53.2,68.3 53.2,78.3
N$15  (via drill 0.3)
  other vias: 50.8,48.4 50.8,49.2 50.8,50 50.8,47.6 50.8,46.8 51.5,47.2 51.5,48 51.5,48.8 51.5,49.6 52.2,49.2 52.2,48.4 52.2,47.6 46,48.4 46,49.2 46,50 46,47.6 46,46.8 45.3,47.2 45.3,48 45.3,48.8 45.3,49.6 44.6,49.2 44.6,48.4 44.6,47.6
  pour Bottom (isolate 0.2, no thermals): 43.3,53.1 43.3,43.1 53.3,43.1 53.3,53.1
  pour Top (isolate 0.2, no thermals): 43.3,53.1 43.3,43.1 53.3,43.1 53.3,53.1
N$16
  Bottom 0.508: LED11.C LED11.C@1 LED12.A@1 LED12.A
N$17
  Bottom 0.508: LED10.C LED10.C@1 LED11.A@1 LED11.A
N$18  (via drill 0.35)
  Top 0.508: v60.8,57.1 v60.8,56.3 v60.8,55.5 60.8,53.35 C6.1
  Bottom 0.508: LED6.C LED6.C@1 48.4,83 50,84.6 57.3,84.6 58.6,83.3 58.6,79.2 60.8,77 v60.8,57.1
  pour Top (isolate 0.2, no thermals): 63.9,53 63.9,53.8 60.2,53.8 60.2,51.4 61.3,51.4 61.3,53
N$19
  pour Top (isolate 0.2, rank 2, no thermals): 64.7,45.8 64.7,29.3 69.5,29.3 69.5,43.3 69.4,43.4 67.4,43.4 67.4,50.6 66.1,50.6 66.1,45.8
N$20  (via drill 0.35)
  Top 0.508: v57.9,26.4 v57.9,27.2 v57.9,28 57.9,34.4 58.2,34.7 58.2,37.1
  Bottom 0.508: LED4.A LED4.A@1 48.4,9.7 50.1,8 56.6,8 57.9,9.3 v57.9,26.4
  pour Top (isolate 0.2, rank 2, no thermals): 60.2,53.8 58.4,53.8 58.4,43.3 55.5,43.3 55.5,29.3 60.2,29.3 60.2,43.3 59.5,43.3 59.5,52.9 60.2,52.9
N$21  (via drill 0.35)
  Top 0.508: v58.7,155.7 C12.2
  Bottom 0.508: LED10.A LED10.A@1 48.4,162.6 49.1,163.3 57.7,163.3 58.7,162.3 v58.7,157.3 v58.7,156.5 v58.7,155.7
  pour Top (isolate 0.2, no thermals): 59.3,154.3 59.2,157.8 58,157.8 57.8,157.6 57.8,155.4 56.11,155.41 56.11,145.04 55.9,143.6 55.9,129.6 60.6,129.6 60.6,143.5 57.4,143.5 57.4,152.5 58.2,153.3 59.3,153.3
N$22  (via drill 0.35)
  Top 0.508: C9.1 9.15,118.7 10.8,117.05 13.85,117.05 v13.9,117 v14.7,117 v15.5,117
  Bottom 0.508: LED9.C LED9.C@1 23,91.6 21.8,90.4 18.9,90.4 17.7,91.6 17.7,115.7 16.4,117 v15.5,117
  pour Top (isolate 0.2, no thermals): 10,121.9 8.6,121.9 8.6,120.5 6,120.5 6,119.7 10,119.7
N$23
  Top 0.254: D5.A 9.3,95.15 R5.2
N$24  (via drill 0.3)
  other vias: 50.8,23.1 50.8,23.9 50.8,24.7 51.5,24.3 51.5,23.5 52.2,23.9 51.5,22.7 52.2,23.1 52.2,22.3 51.5,21.9 50.8,22.3 50.8,21.5 46,23.1 46,23.9 46,24.7 46,22.3 46,21.5 45.3,21.9 45.3,22.7 45.3,23.5 45.3,24.3 44.6,23.9 44.6,23.1 44.6,22.3
  pour Bottom (isolate 0.2, no thermals): 43.2,27.7 43.2,17.7 53.2,17.7 53.2,27.7
  pour Top (isolate 0.2, no thermals): 43.2,27.7 43.2,17.7 53.2,17.7 53.2,27.7
N$25  (via drill 0.3)
  other vias: 25.4,99.2 25.4,100 25.4,100.8 25.4,98.4 25.4,97.6 26.1,98 26.1,98.8 26.1,99.6 26.1,100.4 26.8,100 26.8,99.2 26.8,98.4 20.6,99.2 20.6,100 20.6,100.8 20.6,98.4 20.6,97.6 19.9,98 19.9,98.8 19.9,99.6 19.9,100.4 19.2,100 19.2,99.2 19.2,98.4
  pour Bottom (isolate 0.2, no thermals): 18.1,104 18.1,94 28.1,94 28.1,104
  pour Top (isolate 0.2, no thermals): 18.1,104 18.1,94 28.1,94 28.1,104
N$26  (via drill 0.3)
  other vias: 25.4,124.6 25.4,125.4 25.4,126.2 25.4,123.8 25.4,123 26.1,123.4 26.1,124.2 26.1,125 26.1,125.8 26.8,125.4 26.8,124.6 26.8,123.8 20.6,124.6 20.6,123.8 20.6,123 20.6,125.4 20.6,126.2 19.9,125.8 19.9,125 19.9,124.2 19.9,123.4 19.2,123.8 19.2,124.6 19.2,125.4
  pour Top (isolate 0.2): 18,129.4 18,119.4 28,119.4 28,129.4
  pour Bottom (isolate 0.2, no thermals): 18,129.4 18,119.4 28,119.4 28,129.4
N$27  (via drill 0.3)
  other vias: 20.6,150.1 20.6,150.9 20.6,151.7 20.6,149.3 20.6,148.5 19.9,148.9 19.9,149.7 19.9,150.5 19.9,151.3 19.2,150.9 19.2,150.1 19.2,149.3 25.4,150.1 25.4,149.3 25.4,150.9 25.4,151.7 25.4,148.5 26.1,151.3 26.1,150.5 26.1,149.7 26.1,148.9 26.8,149.3 26.8,150.1 26.8,150.9
  pour Bottom (isolate 0.2, no thermals): 18.1,155.1 18.1,145.1 28.1,145.1 28.1,155.1
  pour Top (isolate 0.2, no thermals): 18.1,155.1 18.1,145.1 28.1,145.1 28.1,155.1
N$28  (via drill 0.3)
  other vias: 50.8,99.2 50.8,100 50.8,100.8 50.8,98.4 50.8,97.6 51.5,98 51.5,98.8 51.5,99.6 51.5,100.4 52.2,100 52.2,99.2 52.2,98.4 46,99.3 46,100.1 46,100.9 46,98.5 46,97.7 45.3,98.1 45.3,98.9 45.3,99.7 45.3,100.5 44.6,100.1 44.6,99.3 44.6,98.5
  pour Bottom (isolate 0.2, no thermals): 43.4,104 43.4,94 53.4,94 53.4,104
  pour Top (isolate 0.2, no thermals): 43.4,104 43.4,94 53.4,94 53.4,104
N$29  (via drill 0.3)
  other vias: 50.8,124.6 50.8,125.4 50.8,126.2 50.8,123.8 50.8,123 51.5,123.4 51.5,124.2 51.5,125 51.5,125.8 52.2,125.4 52.2,124.6 52.2,123.8 46,124.7 46,123.9 46,123.1 46,125.5 46,126.3 45.3,125.9 45.3,125.1 45.3,124.3 45.3,123.5 44.6,123.9 44.6,124.7 44.6,125.5
  pour Bottom (isolate 0.2, no thermals): 43.3,129.4 43.3,119.4 53.3,119.4 53.3,129.4
  pour Top (isolate 0.2, no thermals): 43.3,129.4 43.3,119.4 53.3,119.4 53.3,129.4
N$30  (via drill 0.3)
  other vias: 50.8,150.1 50.8,150.9 50.8,151.7 50.8,149.3 50.8,148.5 46,150.1 51.5,150.5 51.5,151.3 52.2,150.9 51.5,149.7 51.5,148.9 52.2,149.3 52.2,150.1 46,150.9 46,151.7 46,149.3 46,148.5 45.3,148.9 45.3,149.7 45.3,150.5 45.3,151.3 44.6,150.9 44.6,150.1 44.6,149.3
  pour Bottom (isolate 0.2, no thermals): 43.1,155 43.1,145 53.1,145 53.1,155
  pour Top (isolate 0.2, no thermals): 43.1,155 43.1,145 53.1,145 53.1,155
N$32  (via drill 0.3)
  other vias: 20.6,75.4 20.6,74.6 20.6,73.8 20.6,73 20.6,72.2 19.9,72.6 19.9,73.4 19.9,74.2 19.9,75 19.2,74.6 19.2,73.8 19.2,73 25.4,73.8 25.4,74.6 25.4,75.4 26.1,75 26.1,74.2 26.8,74.6 26.8,73.8 26.1,73.4 25.4,73 25.4,72.2 26.1,72.6 26.8,73
  pour Bottom (isolate 0.2, no thermals): 17.8,78.7 17.8,68.7 27.8,68.7 27.8,78.7
  pour Top (isolate 0.2, no thermals): 17.8,78.7 17.8,68.7 27.8,68.7 27.8,78.7
N$44  (via drill 0.3)
  other vias: 25.4,48.4 25.4,49.2 25.4,50 25.4,47.6 25.4,46.8 26.1,47.2 26.1,48 26.1,48.8 26.1,49.6 26.8,49.2 26.8,48.4 26.8,47.6 20.6,48.4 20.6,49.2 20.6,50 20.6,47.6 20.6,46.8 19.9,47.2 19.9,48 19.9,48.8 19.9,49.6 19.2,49.2 19.2,48.4 19.2,47.6
  pour Bottom (isolate 0.2, no thermals): 17.8,53 17.8,43 27.8,43 27.8,53
  pour Top (isolate 0.2, no thermals): 17.8,53 17.8,43 27.8,43 27.8,53
THERMAL  (via drill 0.3)
  other vias: 25.4,23 25.4,23.8 25.4,24.6 25.4,22.2 25.4,21.4 26.1,21.8 26.1,22.6 26.1,23.4 26.1,24.2 26.8,23.8 26.8,23 26.8,22.2 20.6,23 20.6,23.8 20.6,24.6 20.6,22.2 20.6,21.4 19.9,21.8 19.9,22.6 19.9,23.4 19.9,24.2 19.2,23.8 19.2,23 19.2,22.2
  pour Top (isolate 0.2, no thermals): 17.9,27.8 17.9,17.8 27.9,17.8 27.9,27.8
  pour Bottom (isolate 0.2, no thermals): 17.9,27.8 17.9,17.8 27.9,17.8 27.9,27.8

### Text on the board
tNames: vhaus.TECH / vhausALGAE / LED Board - v1.0